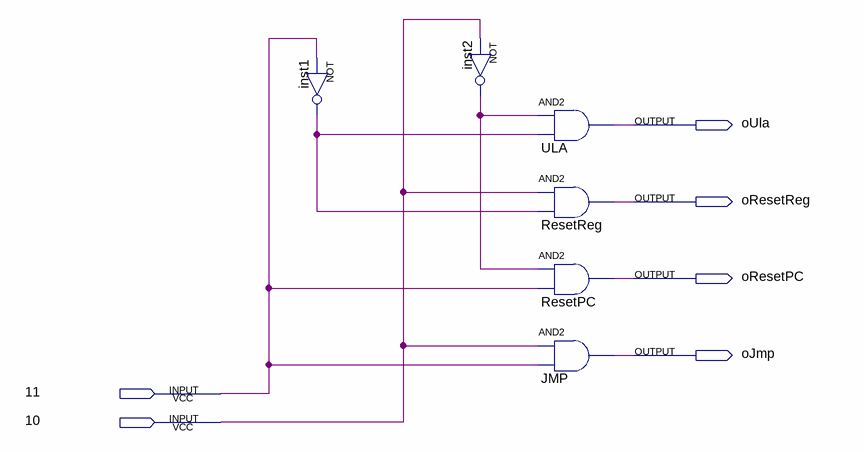
[diagram p0: schematic sheet]
// Quartus schematic uc1.bdf as structural Verilog: 6 symbols, 6 pins
module uc1 (
  input  \11 ,
  input  \10 ,
  output oUla,
  output oResetReg,
  output oResetPC,
  output oJmp
);

  wire inst1_out, inst2_out;

  not inst1 (inst1_out, \11 );
  not inst2 (inst2_out, \10 );
  and ULA (oUla, inst2_out, inst1_out);
  and ResetReg (oResetReg, \10 , inst1_out);
  and ResetPC (oResetPC, inst2_out, \11 );
  and JMP (oJmp, \10 , \11 );
endmodule
